# Altium project spotmini.PrjPcb
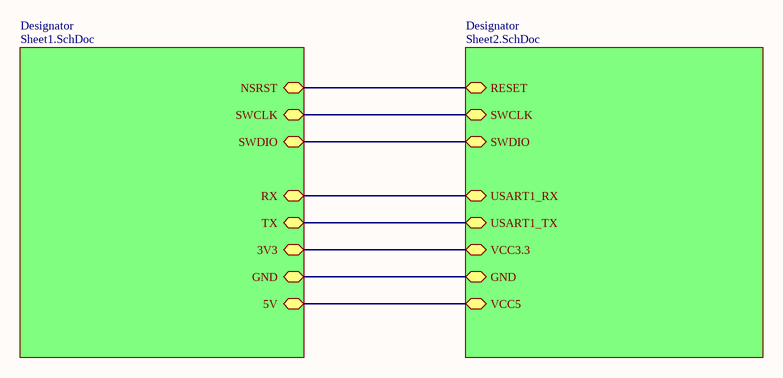
[diagram p0: MAIN.SchDoc]
3 sheets, 69 parts. Net scope: hierarchical (ports join the sheet entries above them; power ports are global).
Board file: PCB1.PcbDoc
Sheets:
  MAIN.SchDoc
    Designator = Sheet1.SchDoc
    Designator = Sheet2.SchDoc

## Sheet MAIN.SchDoc
size A4

### Sub-sheets
Designator = Sheet1.SchDoc: NSRST, SWCLK, SWDIO, RX, TX, 3V3, GND, 5V
Designator = Sheet2.SchDoc: VCC3.3, USART1_TX, USART1_RX, SWCLK, SWDIO, RESET, GND, VCC5

### Nets
5V: sheet Designator/5V, sheet Designator/VCC5
GND: sheet Designator/GND, sheet Designator/GND
VCC3.3: sheet Designator/3V3, sheet Designator/VCC3.3
NSRST: sheet Designator/NSRST, sheet Designator/RESET
RX: sheet Designator/RX, sheet Designator/USART1_RX
SWCLK: sheet Designator/SWCLK, sheet Designator/SWCLK
SWDIO: sheet Designator/SWDIO, sheet Designator/SWDIO
TX: sheet Designator/TX, sheet Designator/USART1_TX

## Sheet Sheet1.SchDoc
size A4; Organization: Altium Limited; Address1: L3, 12a Rodborough Rd; Address2: Frenchs Forest; Address3: NSW; Address4: Australia 2086
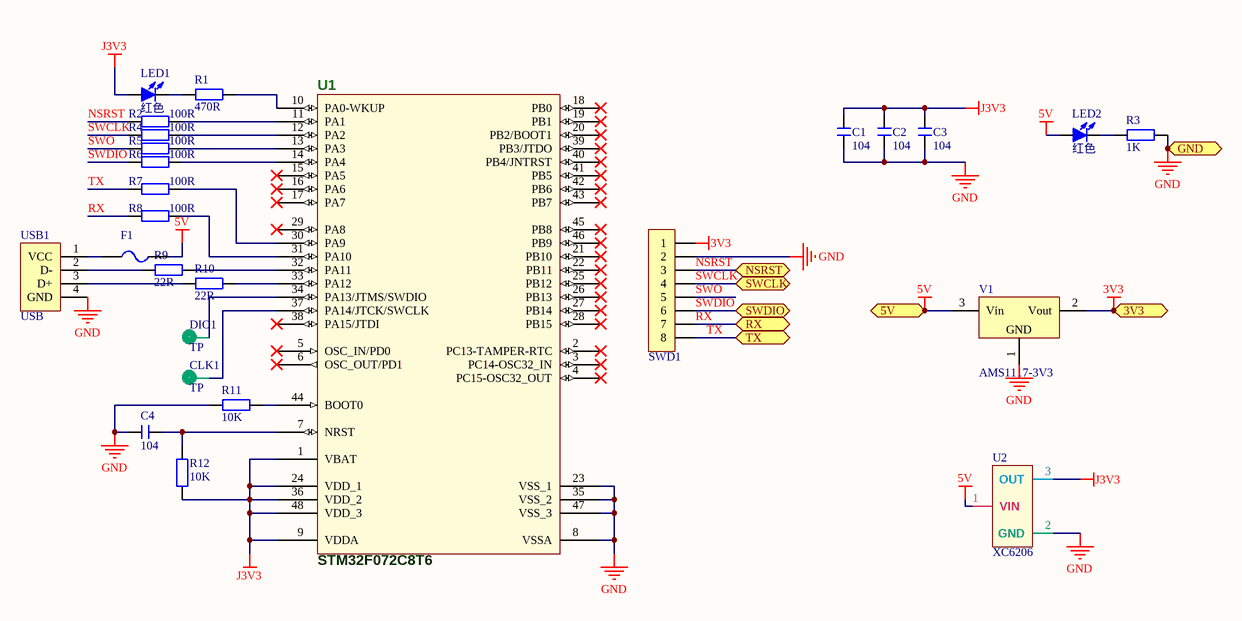
[diagram p1: Sheet1.SchDoc]

### Parts
C1  104  [C 0805]
C2  104  [C 0805]
C3  104  [C 0805]
C4  104  [C 0805]
CLK1  TP  [TP]
DIO1  TP  [TP]
F1  (no value)  [FU 0805]
LED1  红色  [LED 0805G]
LED2  红色  [LED 0805R]
R1  470R  [R 0805-HP]
R2  100R  [R 0805-HP]
R3  1K  [R 0805-HP]
R4  100R  [R 0805-HP]
R5  100R  [R 0805-HP]
R6  100R  [R 0805-HP]
R7  100R  [R 0805-HP]
R8  100R  [R 0805-HP]
R9  22R  [R 0805-HP]
R10  22R  [R 0805-HP]
R11  10K  [R 0805-HP]
R12  10K  [R 0805-HP]
SWD1  HDR-1X8  [HDR-1X8]  (value not drawn)
U1  STM32F072C8T6  [LQFP48P]
U2  XC6206  [XC6206]
USB1  USB  [USB-B/S_A]
V1  AMS1117-3V3  [SOT223_L]

### Ports
3V3, 5V, GND, NSRST, RX, SWCLK, SWDIO, TX

### Nets
3V3: SWD1.1 V1.2(Vout) ; port 3V3  [project net VCC3.3]
5V: F1.2 LED2.1(A) U2.1(VIN) V1.3(Vin) ; port 5V
GND: C1.1 C2.1 C3.1 C4.1 R3.2 R11.1 SWD1.2 U1.8(VSSA) U1.23(VSS_1) U1.35(VSS_2) U1.47(VSS_3) U2.2(GND) USB1.4(GND) V1.1(GND) ; port GND
J3V3: C1.2 C2.2 C3.2 LED1.1(A) R12.1 U1.1(VBAT) U1.9(VDDA) U1.24(VDD_1) U1.36(VDD_2) U1.48(VDD_3) U2.3(OUT)
NSRST: R2.1 SWD1.3 ; port NSRST
RX: R8.1 SWD1.7 ; port RX
SWCLK: R4.1 SWD1.4 ; port SWCLK
SWDIO: R6.1 SWD1.6 ; port SWDIO
SWO: R5.1 SWD1.5
TX: R7.1 SWD1.8 ; port TX
NetC4_2: C4.2 R12.2 U1.7(NRST)
NetCLK1_1: CLK1.1 U1.37(PA14/JTCK/SWCLK)
NetDIO1_1: DIO1.1 U1.34(PA13/JTMS/SWDIO)
NetF1_1: F1.1 USB1.1(VCC)
NetLED1_2: LED1.2(K) R1.1
NetLED2_2: LED2.2(K) R3.1
NetR1_2: R1.2 U1.10(PA0-WKUP)
NetR2_2: R2.2 U1.11(PA1)
NetR4_2: R4.2 U1.12(PA2)
NetR5_2: R5.2 U1.13(PA3)
NetR6_2: R6.2 U1.14(PA4)
NetR7_2: R7.2 U1.30(PA9)
NetR8_2: R8.2 U1.31(PA10)
NetR9_1: R9.1 USB1.2(D-)
NetR9_2: R9.2 U1.32(PA11)
NetR10_1: R10.1 USB1.3(D+)
NetR10_2: R10.2 U1.33(PA12)
NetR11_2: R11.2 U1.44(BOOT0)

Not connected (* = marked no-connect by the designer): U1 2(PC13-TAMPER-RTC)* 3(PC14-OSC32_IN)* 4(PC15-OSC32_OUT)* 5(OSC_IN/PD0)* 6(OSC_OUT/PD1)* 15(PA5)* 16(PA6)* 17(PA7)* 18(PB0)* 19(PB1)* 20(PB2/BOOT1)* 21(PB10)* 22(PB11)* 25(PB12)* 26(PB13)* 27(PB14)* 28(PB15)* 29(PA8)* 38(PA15/JTDI)* 39(PB3/JTDO)* 40(PB4/JNTRST)* 41(PB5)* 42(PB6)* 43(PB7)* 45(PB8)* 46(PB9)*

### Notes on the sheet
- Title
- Size:
- Date:
- A4
- Number:
- Time:
- Revision:
- Sheet
- of
- File:

### Library data of the parts
C1-C4 = C: 无极性贴片电容; 版权归属: 黎明电子style; BOM名称: 无极性贴片电容; 学习资源: https://lmdzstyle.taobao.com/
F1 = FU: 贴片保险丝; 版权归属: 黎明电子style; BOM名称: 贴片保险丝; 学习资源: https://lmdzstyle.taobao.com/
LED1 LED2 = LED-SH-5MM: 5mm草帽LED; 版权归属: 黎明电子style; BOM名称: 5mm草帽LED; 学习资源: https://lmdzstyle.taobao.com/
R1-R12 = R: 贴片电阻; 版权归属: 黎明电子style; BOM名称: 贴片电阻; 学习资源: https://lmdzstyle.taobao.com/
SWD1 = Header 8: 8P接插件; 版权归属: 黎明电子style; BOM名称: 8P接插件; 学习资源: https://lmdzstyle.taobao.com/
USB1 = USB-B/S: USB-B型母接口; 版权归属: 黎明电子style; BOM名称: USB-B型母接口; 学习资源: https://lmdzstyle.taobao.com/
V1 = AMS1117: 三端稳压芯片; BOM名称: 稳压芯片; 版权归属: 黎明电子style; 学习资源: https://lmdzstyle.taobao.com/

## Sheet Sheet2.SchDoc
size A2
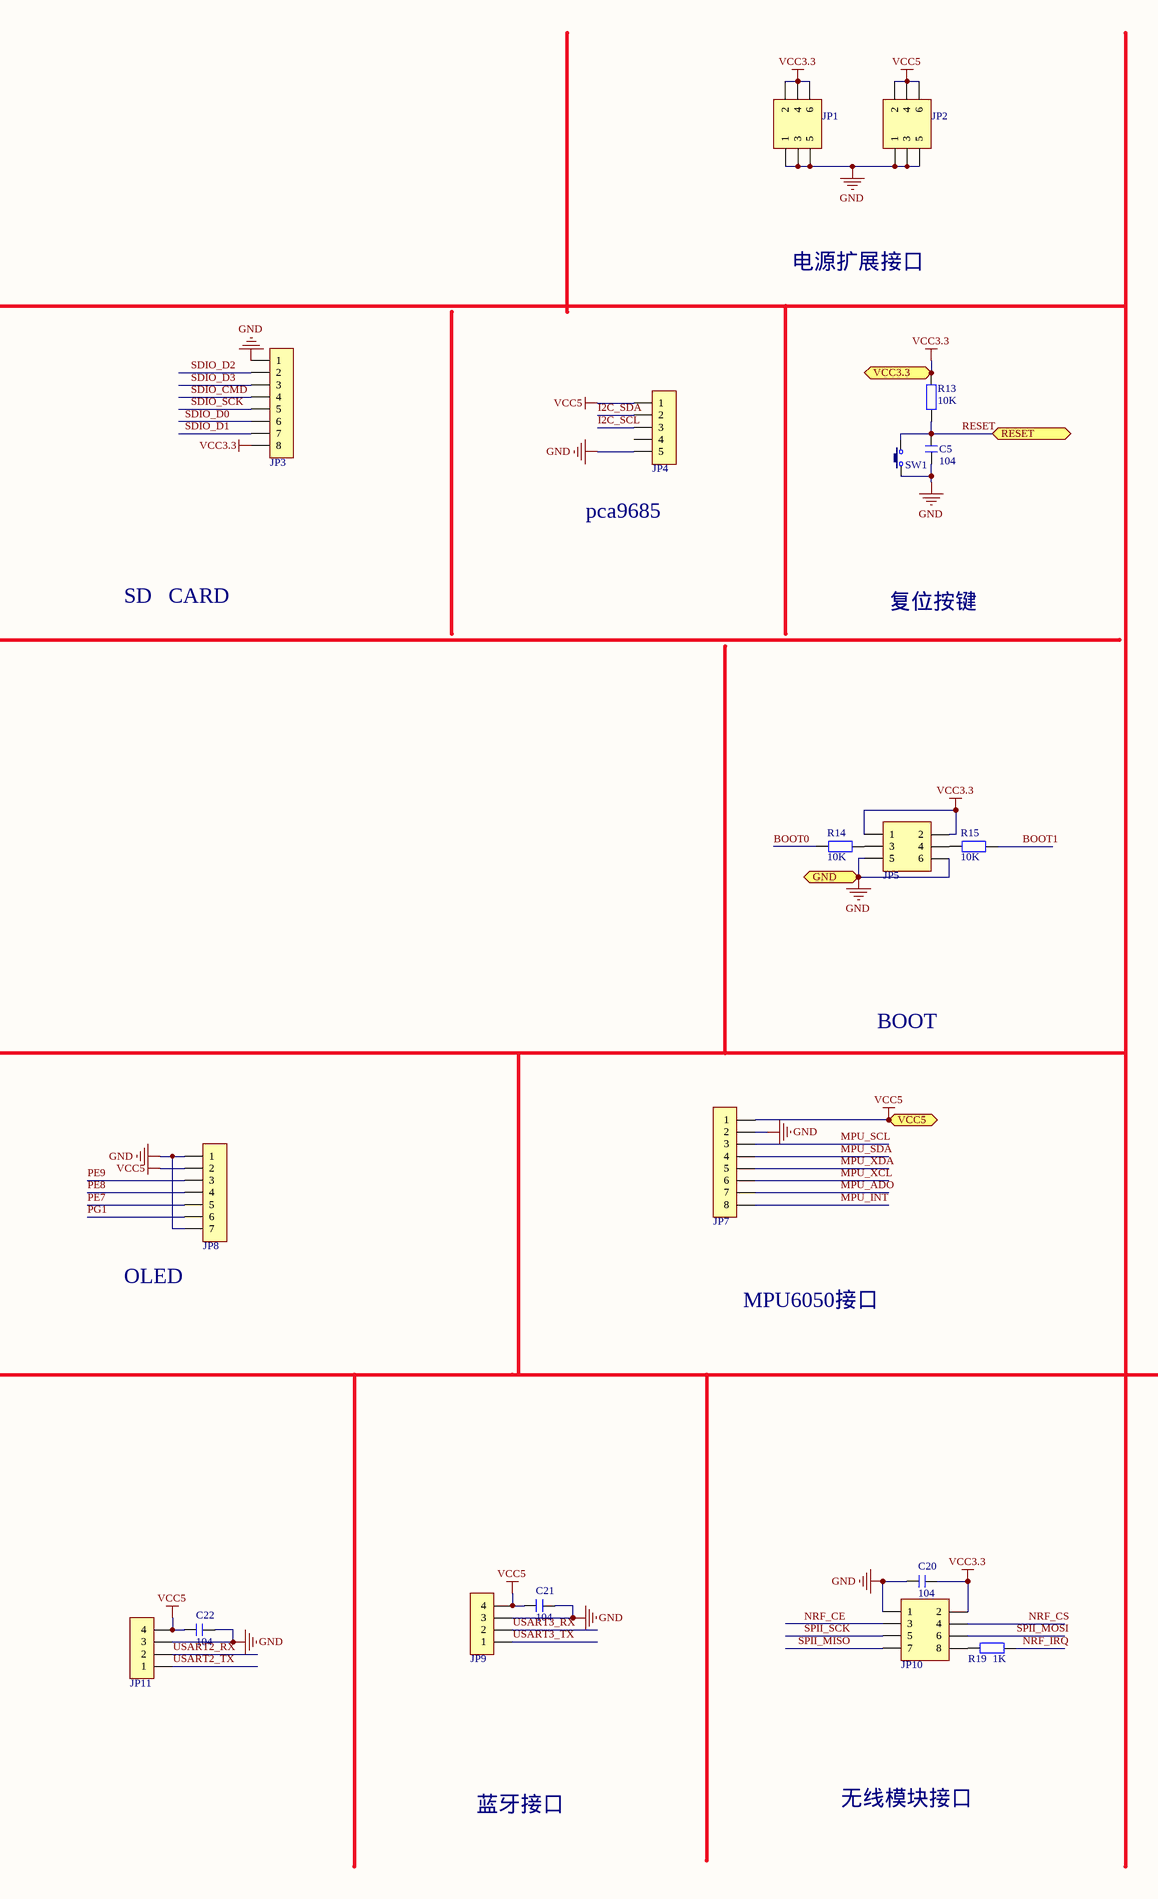
[diagram p2: Sheet2.SchDoc, left]
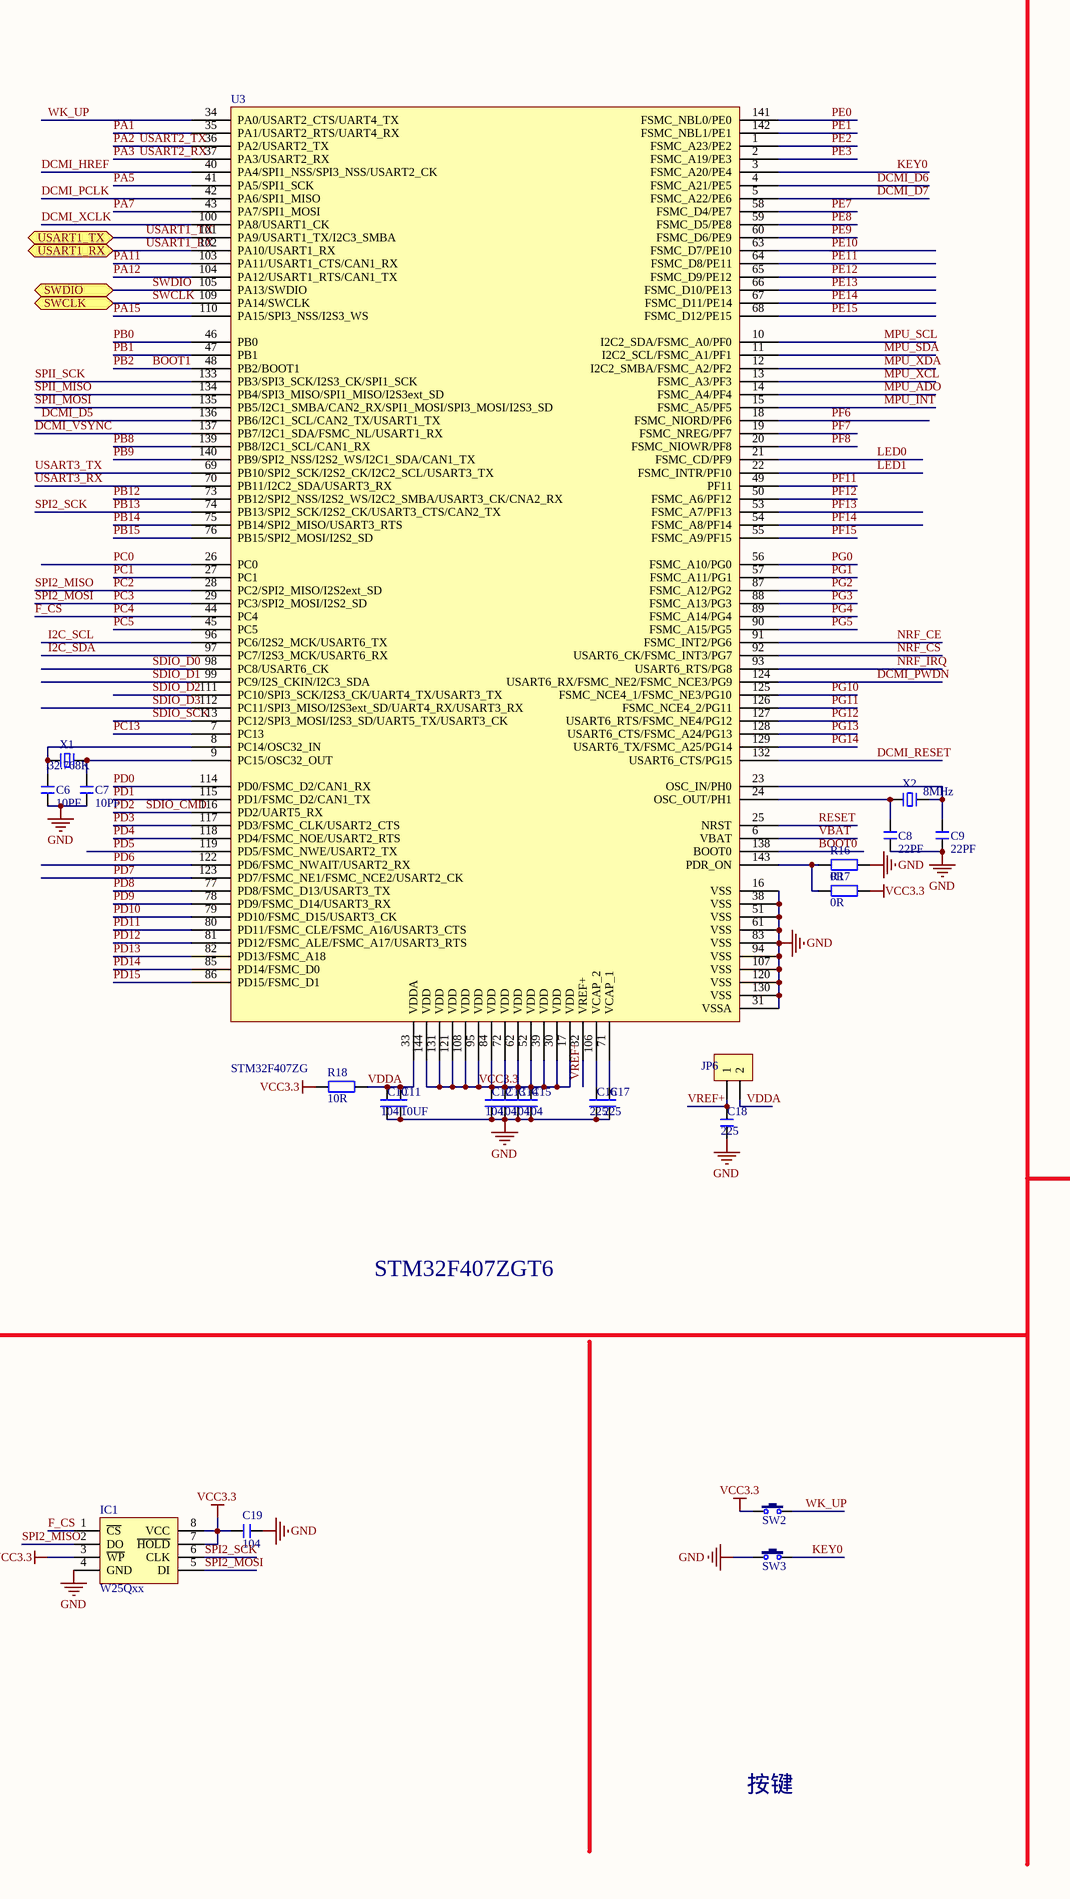
[diagram p3: Sheet2.SchDoc, right]

### Parts
C5  104  [C 0603]
C6  10PF  [C 0603]
C7  10PF  [C 0603]
C8  22PF  [C 0603]
C9  22PF  [C 0603]
C10  104  [C 0603]
C11  10UF  [C 0805]
C12  104  [C 0603]
C13  104  [C 0603]
C14  104  [C 0603]
C15  104  [C 0603]
C16  225  [C 0603]
C17  225  [C 0603]
C18  225  [C 0603]
C19  104  [C 0603]
C20  104  [C 0603]
C21  104  [C 0603]
C22  104  [C 0603]
IC1  W25Qxx  [SOP8W_N]
JP1  Header3X2  [HDR-3X2]  (value not drawn)
JP2  Header3X2  [HDR-3X2]  (value not drawn)
JP3  HDR-1X8  [HDR-1X8]  (value not drawn)
JP4  HDR-1X5  [HDR-1X5]  (value not drawn)
JP5  Header3X2  [HDR-3X2]  (value not drawn)
JP6  HDR-1X2  [HDR-1X2]  (value not drawn)
JP7  HDR-1X8  [HDR-1X8_M]  (value not drawn)
JP8  HDR-1X7  [HDR-1X7]  (value not drawn)
JP9  HDR-1X4  [HDR-1X4_M]  (value not drawn)
JP10  Header 4X2  [HDR-4X2]  (value not drawn)
JP11  HDR-1X4  [HDR-1X4_M]  (value not drawn)
R13  10K  [R 0603]
R14  10K  [R 0603]
R15  10K  [R 0603]
R16  0R  [R 0603]
R17  0R  [R 0603]
R18  10R  [R 0603]
R19  1K  [R 0603]
SW1  3x6x5  [TSW SMD-3*6*2.5]  (value not drawn)
SW2  3x6x5  [TSW SMD-3*6*2.5]  (value not drawn)
SW3  3x6x5  [TSW SMD-3*6*2.5]  (value not drawn)
U3  STM32F407ZG  [LQFP144 20X20_M]
X1  32.768K  [XTAL-3X8]
X2  8MHz  [XTAL-49S DIP]

### Ports
GND, RESET, SWCLK, SWDIO, USART1_RX, USART1_TX, VCC3.3, VCC5

### Nets
GND: C5.1 C6.1 C7.1 C8.1 C9.1 C10.1 C11.1 C12.1 C13.1 C14.1 C15.1 C16.1 C17.1 C18.1 C19.2 C20.2 C21.1 C22.1 IC1.4(GND) JP1.1 JP1.3 JP1.5 JP2.1 JP2.3 JP2.5 JP3.1 JP4.5 JP5.5 JP5.6 JP7.2 JP8.1 JP8.7 JP9.3 JP10.1 JP11.3 R16.1 SW1.1 SW3.1 U3.16(VSS) U3.31(VSSA) U3.38(VSS) U3.51(VSS) U3.61(VSS) U3.83(VSS) U3.94(VSS) U3.107(VSS) U3.120(VSS) U3.130(VSS) ; port GND
VCC3.3: C12.2 C13.2 C14.2 C15.2 C19.1 C20.1 IC1.3(~{WP}) IC1.7(~{HOLD}) IC1.8(VCC) JP1.2 JP1.4 JP1.6 JP3.8 JP5.1 JP5.2 JP10.2 R13.2 R17.1 R18.2 SW2.1 U3.17(VDD) U3.30(VDD) U3.39(VDD) U3.52(VDD) U3.62(VDD) U3.72(VDD) U3.84(VDD) U3.95(VDD) U3.108(VDD) U3.121(VDD) U3.131(VDD) U3.144(VDD) ; port VCC3.3
VCC5: C21.2 C22.2 JP2.2 JP2.4 JP2.6 JP4.1 JP7.1 JP8.2 JP9.4 JP11.4 ; port VCC5  [project net 5V]
BOOT0: R14.2 U3.138(BOOT0)
BOOT1: R15.1 U3.48(PB2/BOOT1)  [also labelled PB2]
DCMI_D5: U3.136(PB6/I2C1_SCL/CAN2_TX/USART1_TX)
DCMI_D6: U3.4(FSMC_A21/PE5)
DCMI_D7: U3.5(FSMC_A22/PE6)
DCMI_HREF: U3.40(PA4/SPI1_NSS/SPI3_NSS/USART2_CK)
DCMI_PCLK: U3.42(PA6/SPI1_MISO)
DCMI_PWDN: U3.124(USART6_RX/FSMC_NE2/FSMC_NCE3/PG9)
DCMI_RESET: U3.132(USART6_CTS/PG15)
DCMI_VSYNC: U3.137(PB7/I2C1_SDA/FSMC_NL/USART1_RX)
DCMI_XCLK: U3.100(PA8/USART1_CK)
F_CS: IC1.1(~{CS}) U3.44(PC4)  [also labelled PC4]
I2C_SCL: JP4.3 U3.96(PC6/I2S2_MCK/USART6_TX)
I2C_SDA: JP4.2 U3.97(PC7/I2S3_MCK/USART6_RX)
KEY0: SW3.2 U3.3(FSMC_A20/PE4)
LED0: U3.21(FSMC_CD/PF9)
LED1: U3.22(FSMC_INTR/PF10)
MPU_ADO: JP7.7 U3.14(FSMC_A4/PF4)
MPU_INT: JP7.8 U3.15(FSMC_A5/PF5)
MPU_SCL: JP7.3 U3.10(I2C2_SDA/FSMC_A0/PF0)
MPU_SDA: JP7.4 U3.11(I2C2_SCL/FSMC_A1/PF1)
MPU_XCL: JP7.6 U3.13(FSMC_A3/PF3)
MPU_XDA: JP7.5 U3.12(I2C2_SMBA/FSMC_A2/PF2)
NRF_CE: JP10.3 U3.91(FSMC_INT2/PG6)
NRF_CS: JP10.4 U3.92(USART6_CK/FSMC_INT3/PG7)
NRF_IRQ: R19.1 U3.93(USART6_RTS/PG8)
PA1: U3.35(PA1/USART2_RTS/UART4_RX)
PA2: JP11.1 U3.36(PA2/USART2_TX)  [also labelled USART2_TX]
PA3: JP11.2 U3.37(PA3/USART2_RX)  [also labelled USART2_RX]
PA5: U3.41(PA5/SPI1_SCK)
PA7: U3.43(PA7/SPI1_MOSI)
PA11: U3.103(PA11/USART1_CTS/CAN1_RX)
PA12: U3.104(PA12/USART1_RTS/CAN1_TX)
PA15: U3.110(PA15/SPI3_NSS/I2S3_WS)
PB0: U3.46(PB0)
PB1: U3.47(PB1)
PB8: U3.139(PB8/I2C1_SCL/CAN1_RX)
PB9: U3.140(PB9/SPI2_NSS/I2S2_WS/I2C1_SDA/CAN1_TX)
PB12: U3.73(PB12/SPI2_NSS/I2S2_WS/I2C2_SMBA/USART3_CK/CNA2_RX)
PB13: IC1.6(CLK) U3.74(PB13/SPI2_SCK/I2S2_CK/USART3_CTS/CAN2_TX)  [also labelled SPI2_SCK]
PB14: U3.75(PB14/SPI2_MISO/USART3_RTS)
PB15: U3.76(PB15/SPI2_MOSI/I2S2_SD)
PC0: U3.26(PC0)
PC1: U3.27(PC1)
PC2: IC1.2(DO) U3.28(PC2/SPI2_MISO/I2S2ext_SD)  [also labelled SPI2_MISO]
PC3: IC1.5(DI) U3.29(PC3/SPI2_MOSI/I2S2_SD)  [also labelled SPI2_MOSI]
PC5: U3.45(PC5)
PC13: U3.7(PC13)
PD0: U3.114(PD0/FSMC_D2/CAN1_RX)
PD1: U3.115(PD1/FSMC_D2/CAN1_TX)
PD2: JP3.4 U3.116(PD2/UART5_RX)  [also labelled SDIO_CMD]
PD3: U3.117(PD3/FSMC_CLK/USART2_CTS)
PD4: U3.118(PD4/FSMC_NOE/USART2_RTS)
PD5: U3.119(PD5/FSMC_NWE/USART2_TX)
PD6: U3.122(PD6/FSMC_NWAIT/USART2_RX)
PD7: U3.123(PD7/FSMC_NE1/FSMC_NCE2/USART2_CK)
PD8: U3.77(PD8/FSMC_D13/USART3_TX)
PD9: U3.78(PD9/FSMC_D14/USART3_RX)
PD10: U3.79(PD10/FSMC_D15/USART3_CK)
PD11: U3.80(PD11/FSMC_CLE/FSMC_A16/USART3_CTS)
PD12: U3.81(PD12/FSMC_ALE/FSMC_A17/USART3_RTS)
PD13: U3.82(PD13/FSMC_A18)
PD14: U3.85(PD14/FSMC_D0)
PD15: U3.86(PD15/FSMC_D1)
PE0: U3.141(FSMC_NBL0/PE0)
PE1: U3.142(FSMC_NBL1/PE1)
PE2: U3.1(FSMC_A23/PE2)
PE3: U3.2(FSMC_A19/PE3)
PE7: JP8.5 U3.58(FSMC_D4/PE7)
PE8: JP8.4 U3.59(FSMC_D5/PE8)
PE9: JP8.3 U3.60(FSMC_D6/PE9)
PE10: U3.63(FSMC_D7/PE10)
PE11: U3.64(FSMC_D8/PE11)
PE12: U3.65(FSMC_D9/PE12)
PE13: U3.66(FSMC_D10/PE13)
PE14: U3.67(FSMC_D11/PE14)
PE15: U3.68(FSMC_D12/PE15)
PF6: U3.18(FSMC_NIORD/PF6)
PF7: U3.19(FSMC_NREG/PF7)
PF8: U3.20(FSMC_NIOWR/PF8)
PF11: U3.49(PF11)
PF12: U3.50(FSMC_A6/PF12)
PF13: U3.53(FSMC_A7/PF13)
PF14: U3.54(FSMC_A8/PF14)
PF15: U3.55(FSMC_A9/PF15)
PG0: U3.56(FSMC_A10/PG0)
PG1: JP8.6 U3.57(FSMC_A11/PG1)
PG2: U3.87(FSMC_A12/PG2)
PG3: U3.88(FSMC_A13/PG3)
PG4: U3.89(FSMC_A14/PG4)
PG5: U3.90(FSMC_A15/PG5)
PG10: U3.125(FSMC_NCE4_1/FSMC_NE3/PG10)
PG11: U3.126(FSMC_NCE4_2/PG11)
PG12: U3.127(USART6_RTS/FSMC_NE4/PG12)
PG13: U3.128(USART6_CTS/FSMC_A24/PG13)
PG14: U3.129(USART6_TX/FSMC_A25/PG14)
RESET: C5.2 R13.1 SW1.2 U3.25(NRST) ; port RESET  [project net NSRST]
SDIO_D0: JP3.6 U3.98(PC8/USART6_CK)
SDIO_D1: JP3.7 U3.99(PC9/I2S_CKIN/I2C3_SDA)
SDIO_D2: JP3.2 U3.111(PC10/SPI3_SCK/I2S3_CK/UART4_TX/USART3_TX)
SDIO_D3: JP3.3 U3.112(PC11/SPI3_MISO/I2S3ext_SD/UART4_RX/USART3_RX)
SDIO_SCK: JP3.5 U3.113(PC12/SPI3_MOSI/I2S3_SD/UART5_TX/USART3_CK)
SPII_MISO: JP10.7 U3.134(PB4/SPI3_MISO/SPI1_MISO/I2S3ext_SD)
SPII_MOSI: JP10.6 U3.135(PB5/I2C1_SMBA/CAN2_RX/SPI1_MOSI/SPI3_MOSI/I2S3_SD)
SPII_SCK: JP10.5 U3.133(PB3/SPI3_SCK/I2S3_CK/SPI1_SCK)
SWCLK: U3.109(PA14/SWCLK) ; port SWCLK
SWDIO: U3.105(PA13/SWDIO) ; port SWDIO
USART1_RX: U3.102(PA10/USART1_RX) ; port USART1_RX  [project net RX]
USART1_TX: U3.101(PA9/USART1_TX/I2C3_SMBA) ; port USART1_TX  [project net TX]
USART3_RX: JP9.2 U3.70(PB11/I2C2_SDA/USART3_RX)
USART3_TX: JP9.1 U3.69(PB10/SPI2_SCK/I2S2_CK/I2C2_SCL/USART3_TX)
VBAT: U3.6(VBAT)
VDDA: C10.2 C11.2 JP6.2 R18.1 U3.33(VDDA)
VREF+: C18.2 JP6.1 U3.32(VREF+)
WK_UP: SW2.2 U3.34(PA0/USART2_CTS/UART4_TX)
NetC6_2: C6.2 U3.8(PC14/OSC32_IN) X1.1
NetC7_2: C7.2 U3.9(PC15/OSC32_OUT) X1.2
NetC8_2: C8.2 U3.24(OSC_OUT/PH1) X2.1
NetC9_2: C9.2 U3.23(OSC_IN/PH0) X2.2
NetC16_2: C16.2 U3.106(VCAP_2)
NetC17_2: C17.2 U3.71(VCAP_1)
NetJP5_3: JP5.3 R14.1
NetJP5_4: JP5.4 R15.2
NetJP10_8: JP10.8 R19.2
NetR16_2: R16.2 R17.2 U3.143(PDR_ON)

Not connected (* = marked no-connect by the designer): JP4 4

### Notes on the sheet
- 电源扩展接口
- pca9685
- SD   CARD
- 复位按键
- BOOT
- OLED
- MPU6050接口
- STM32F407ZGT6
- 按键
- 蓝牙接口
- 无线模块接口

### Library data of the parts
C5-C22 = C: 无极性贴片电容; 版权归属: 源创客; BOM名称: 无极性贴片电容; 学习资源: www.ooocke.com
IC1 = W25Qxx: 外置Flash; 版权归属: 黎明电子style; BOM名称: 外置Flash; 学习资源: https://lmdzstyle.taobao.com/
JP1 JP2 JP5 = Header 3X2: 3*2P接插件; 版权归属: 源创客; BOM名称: 3*2P接插件; 学习资源: www.ooocke.com
JP3 = Header 8: 8P接插件; 版权归属: 黎明电子style; BOM名称: 8P接插件; 学习资源: https://lmdzstyle.taobao.com/
JP4 = Header 5: 5P接插件; 版权归属: 黎明电子style; BOM名称: 5P接插件; 学习资源: https://lmdzstyle.taobao.com/
JP6 = Header 2: 2P接插件; 版权归属: 源创客; BOM名称: 2P接插件; 学习资源: www.ooocke.com
JP7 = Header 8: 8P接插件; 版权归属: 源创客; BOM名称: 8P接插件; 学习资源: www.ooocke.com
JP8 = Header 7: 7P接插件; 版权归属: 黎明电子style; BOM名称: 7P接插件; 学习资源: https://lmdzstyle.taobao.com/
JP9 JP11 = Header 4: 4P接插件; 版权归属: 源创客; BOM名称: 4P接插件; 学习资源: www.ooocke.com
JP10 = Header 4X2: 4*2P接插件; 版权归属: 源创客; BOM名称: 4*2P接插件; 学习资源: www.ooocke.com
R13-R19 = R: 贴片电阻; 版权归属: 源创客; BOM名称: 贴片电阻; 学习资源: www.ooocke.com
SW1-SW3 = TSW 3x6: 3x6轻触开关; 版权归属: 源创客; BOM名称: 3x6轻触开关; 学习资源: www.ooocke.com
U3 = STM32F407ZG: Flaah:1024/RAM:192/IO:114; BOM名称: 32位ST单片机; 版权归属: 源创客; 学习资源: www.ooocke.com
X1 X2 = XTAL-2: 2脚晶振; 版权归属: 源创客; BOM名称: 2脚晶振; 学习资源: www.ooocke.com

## Nets that join several sheets
5V: Sheet1 (F1.2 LED2.1 U2.1 V1.3), Sheet2 (10 pins)
GND: Sheet1 (14 pins), Sheet2 (48 pins)
VCC3.3: Sheet1 (SWD1.1 V1.2), Sheet2 (32 pins)
NSRST: Sheet1 (R2.1 SWD1.3), Sheet2 (C5.2 R13.1 SW1.2 U3.25)
RX: Sheet1 (R8.1 SWD1.7), Sheet2 (U3.102)
SWCLK: Sheet1 (R4.1 SWD1.4), Sheet2 (U3.109)
SWDIO: Sheet1 (R6.1 SWD1.6), Sheet2 (U3.105)
TX: Sheet1 (R7.1 SWD1.8), Sheet2 (U3.101)